# Altium schematic sheet Connector.SchDoc
size A4; SheetNumber: 1; SheetTotal: 5
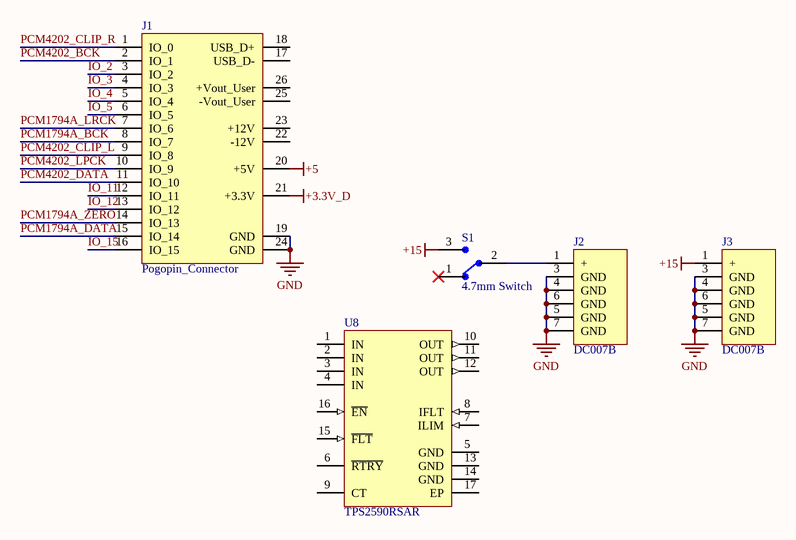
[diagram p0: Connector.SchDoc]

## Parts
J1  Pogopin_Connector  [26P_Pogopin]
J2  DC007B  [CONN2_ADC-096-2-T/R_ADM]
J3  DC007B  [CONN2_ADC-096-2-T/R_ADM]
S1  4.7mm Switch  [SW_1101M2S3CQE2]
U8  TPS2590RSAR  [FP-RSA0016B-MFG]

## Nets
+3.3V_D: J1.21(+3.3V)
+5: J1.20(+5V)
+15: J3.1(+) S1.3
GND: J1.19(GND) J1.24(GND) J2.3(GND) J2.4(GND) J2.5(GND) J2.6(GND) J2.7(GND) J3.3(GND) J3.4(GND) J3.5(GND) J3.6(GND) J3.7(GND)
IO_2: J1.3(IO_2)
IO_3: J1.4(IO_3)
IO_4: J1.5(IO_4)
IO_5: J1.6(IO_5)
IO_11: J1.12(IO_11)
IO_12: J1.13(IO_12)
IO_15: J1.16(IO_15)
PCM1794A_BCK: J1.8(IO_7)
PCM1794A_DATA: J1.15(IO_14)
PCM1794A_LRCK: J1.7(IO_6)
PCM1794A_ZERO: J1.14(IO_13)
PCM4202_BCK: J1.2(IO_1)
PCM4202_CLIP_L: J1.9(IO_8)
PCM4202_CLIP_R: J1.1(IO_0)
PCM4202_DATA: J1.11(IO_10)
PCM4202_LPCK: J1.10(IO_9)
NetJ2_1: J2.1(+) S1.2

Not connected (* = marked no-connect by the designer): J1 17(USB_D-) 18(USB_D+) 22(-12V) 23(+12V) 25(-Vout_User) 26(+Vout_User); S1 1*; U8 1(IN) 2(IN) 3(IN) 4(IN) 5(GND) 6(~{RTRY}) 7(ILIM) 8(IFLT) 9(CT) 10(OUT) 11(OUT) 12(OUT) 13(GND) 14(GND) 15(~{FLT}) 16(~{EN}) 17(EP)

## Library data of the parts
J1 = Pogopin_Connector: Pogopin connector suits Raindrop-S
J2 J3 = DC007B: 5521; Mfr_Name: ADAM TECHNOLOGIES INC; Manufacturer_Part_Number: ADC-096-2-T/R; Copyright: Copyright (C) 2022 Ultra Librarian. All rights reserved.; RefDes: RefDes; Type: DEV
S1 = 4.7mm Switch: Slide Switch SPDT Through Hole; MP: 1101M2S3CQE2; MF: C&K; SnapEDA_Link: https://www.snapeda.com/parts/1101M2S3CQE2/C%26K/view-part/287375/?ref=snap; Value: *; Digi-Key_Part_Number: CKN5001-ND; Digi-Key_Purchase_URL: https://www.digikey.fr/product-detail/en/c-k/1101M2S3CQE2/CKN5001-ND/67042?utm_source=snapeda&utm_medium=aggregator&utm_campaign=symbol; Package: None
U8 = CMP-0334-00005-3: IC HOT SWAP CTRLR GP 16QFN; Number of Outputs: 1; Max Supply Voltage: 20V; Max Output Current: 5.5A; Output Current: 0A; Min Supply Voltage: 3V; Package Quantity: 3000; Length: 4mm; Weight: 0.001623oz; Number of Pins: 16; Max Input Voltage: 20V; Packaging: Tape and Reel; Series: -; Height: 0.9mm; Case/Package: QFN; RoHS Compliant: Yes; Features: Thermal Limit; Radiation Hardening: No; Min Operating Temperature: -40°C; Min Input Voltage: 3V; Number of Channels: 1; Max Operating Temperature: 125°C; Lead Free: Lead Free